# Altium project F1_MODULE.PrjPcb (part 2 of 2)

## Sheet PROTECTION AND POWER_SUPPLY.SchDoc
size A; SheetNumber: 4; SheetTotal: 4
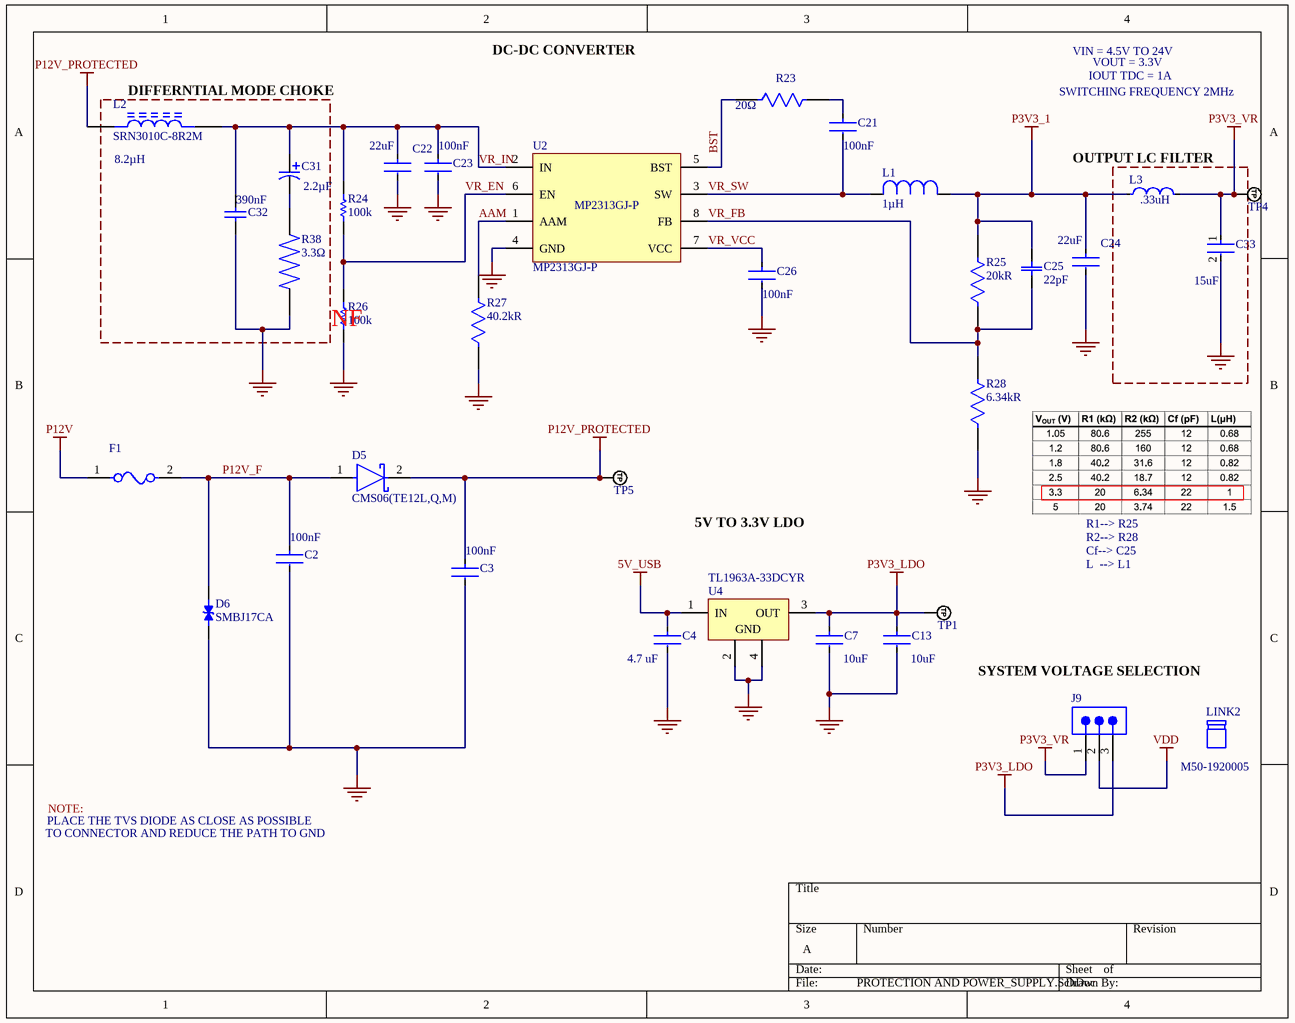
[diagram p3: PROTECTION AND POWER_SUPPLY.SchDoc]

### Parts
C2  Capacitance: 100nF  [FP-0402-L_1_0_0_05-W_0_5-MFG]  (hidden comment: TMK105B7104KVHF)
C3  Capacitance: 100nF  [FP-0402-L_1_0_0_05-W_0_5-MFG]  (hidden comment: TMK105B7104KVHF)
C4  Capacitance: 4.7 uF  [FP-CC0603-DA-MFG]  (hidden comment: CC0603KRX5R7BB475)
C7  Capacitance: 10uF  [FP-0805-L_2_0_0_2-W_1_25-MFG]  (hidden comment: EMK212BB7106KG-T)
C13  Capacitance: 10uF  [FP-0805-L_2_0_0_2-W_1_25-MFG]  (hidden comment: EMK212BB7106KG-T)
C21  Capacitance: 100nF  [FP-0402-L_1_0_0_05-W_0_5-MFG]  (hidden comment: TMK105B7104KVHF)
C22  Capacitance: 22uF  [FP-1210-L_3_2_0_3-W_2_5_0-MFG]  (hidden comment: TMK325B7226KMHP)
C23  Capacitance: 100nF  [FP-0402-L_1_0_0_05-W_0_5-MFG]  (hidden comment: TMK105B7104KVHF)
C24  Capacitance: 22uF  [FP-1210-L_3_2_0_3-W_2_5_0-MFG]  (hidden comment: TMK325B7226KMHP)
C25  value 22pF  [CAP_0805]  (hidden comment: 0805YA220K4T2A)
C26  Capacitance: 100nF  [FP-0402-L_1_0_0_05-W_0_5-MFG]  (hidden comment: TMK105B7104KVHF)
C31  value 2.2µF  [CAP_EEE_B_PAN]  (hidden comment: EEE-1HA2R2SR)
C32  value 390nF  [CAPC0805(2012)110_N]  (hidden comment: C0805C394K5RACTU)
C33  Capacitance: 15uF  [FP-C2012-125-0_2-MFG]  (hidden comment: C2012X5R1E156M125AC)
D5  CMS06(TE12L,Q,M)  [FP-M-FLAT-MFG]
D6  SMBJ17CA  [SMBJSeries_LTF]
F1  MINISMDC110F/24-2  [FP-MINISMDC110F-24-2-MFG]  (value not drawn)
J9  61300311121  [61300311121]  (value not drawn)
L1  value 1µH  [IND_MDMK2020T1R0MM_TAY]  (hidden comment: MDMK2020T1R0MMV)
L2  SRN3010C-8R2M  value 8.2µH  [IND_SRN3010C-8R2M]
L3  Inductance value: .33uH  [FP-DFE201210U-MFG]  (hidden comment: DFE201210U-R33M=P2)
LINK2  M50-1920005  (mechanical)
R23  Resistance: 20Ω  [FP-RT0402-MFG]  (hidden comment: RT0402FRE0720RL)
R24  value 100k  [RESC1005X40X25NL05T10]  (hidden comment: RC0402FR-07100KL)
R25  Resistance: 20kR  [FP-AF0402-MFG]  (hidden comment: AF0402JR-0720KL)
R26  value 100k  [RESC1005X40X25NL05T10]  (hidden comment: RC0402FR-07100KL)
R27  Resistance: 40.2kR  [FP-AF0402-MFG]  (hidden comment: AF0402FR-0740K2L)
R28  Resistance: 6.34kR  [FP-MCT0603-MFG]  (hidden comment: MCT06030C6341FP500)
R38  value 3.3Ω  [RESC6331X80N]  (hidden comment: CRM2512-JW-3R3ELF)
TP1  TP_NOBOM  [PAD_RND_1MM]  (value not drawn)  (no BOM)
TP4  TP_NOBOM  [PAD_RND_1MM]  (value not drawn)  (no BOM)
TP5  TP_NOBOM  [PAD_RND_1MM]  (value not drawn)  (no BOM)
U2  MP2313GJ-P  [TSOT23-8_MP2313_MNP]
U4  TL1963A-33DCYR  [DCY0004A_N]

### Blocks framed on the sheet
DIFFERNTIAL MODE CHOKE: C31 C32 L2 R38

### Nets
5V_USB: C4.1 U4.1(IN)
GND: C2.2 C3.2 C4.2 C7.2 C13.2 C22.2 C23.2 C24.2 C26.2 C32.1 C33.2 D6.1 R26.1 R27.1 R28.1 R38.2 U2.4(GND) U4.2(GND) U4.4(GND)
P3V3_1: C24.1 C25.2 L1.1 L3.1 R25.2
P3V3_LDO: C7.1 C13.1 J9.3 TP1.1(TP) U4.3(OUT)
P3V3_VR: C33.1 J9.1 L3.2 TP4.1(TP)
P12V: F1.1
P12V_PROTECTED: C3.1 D5.2(C) L2.1 TP5.1(TP)
VDD: J9.2
AAM: R27.2 U2.1(AAM)
BST: R23.1 U2.5(BST)
P12V_F: C2.1 D5.1(A) D6.2 F1.2
VR_EN: R24.1 R26.2 U2.6(EN)
VR_FB: C25.1 R25.1 R28.2 U2.8(FB)
VR_IN: C22.1 C23.1 C31.1 C32.2 L2.2 R24.2 U2.2(IN)
VR_SW: C21.2 L1.2 U2.3(SW)
VR_VCC: C26.1 U2.7(VCC)
NetC21_1: C21.1 R23.2
NetC31_2: C31.2 R38.1

### Notes on the sheet
- DC-DC CONVERTER
- SWITCHING FREQUENCY 2MHz
- VIN = 4.5V TO 24V
- IOUT TDC = 1A
- VOUT = 3.3V
- (near L3) OUTPUT LC FILTER
- (near R26) NF
- 5V TO 3.3V LDO
- R1--> R25
- R2--> R28
- Cf--> C25
- L  --> L1
- SYSTEM VOLTAGE SELECTION
- TO CONNECTOR AND REDUCE THE PATH TO GND
- PLACE THE TVS DIODE AS CLOSE AS POSSIBLE
- NOTE:

### Library data of the parts
C2 C3 C23 C26 = CMP-14477-000162-2: 0.1 µF ±10% 25V Condensatori ceramici X7R 0402 (1005 metrico); Case/Package: 0402; Dielectric: X7R; Halogen Free: Halogen Free; Ratings: AEC-Q200; Lead Free: Lead Free; Case Code (Metric): 1005; Mount: Surface Mount; Max Operating Temperature: 125°C; Case Code (Imperial): 0402; Termination: SMD/SMT; Min Operating Temperature: -55°C; Weight: 2.3E-05oz; Width: 0.02inch; Height: 0.5mm; Thickness: 0.022inch; Voltage Rating (DC): 25V; RoHS Compliant: Yes; Length: 0.039inch; Voltage Rating: 25V; Package Quantity: 10000; Packaging: Tape and Reel; Tolerance: 10%
C4 = CMP-03422-001236-1: CAP CER 4.7UF 16V X5R 0603; Manufacturer: YAGEO; Temperature Coefficient: 15%; Material: Ceramic; Tolerance: 0.1; Temperature Characteristic: X5R; Footprint Url: http://www.yageo.com/exep/pages/download/literatures/UPY-C_GEN_24.pdf; ComponentLink2URL: http://www.yageo.com/documents/recent/UPY-GPHC_X7R_6.3V-to-50V_18.pdf; ComponentLink2Description: Datasheet; Device Class L3: Ceramic Capacitors; Category: Cap; Voltage Rating: 16 V; Automotive: No; Temperature Range High: +125°C; Value: 4.7 uF; Device Class L1: Passive Components; RoHS: TRUE; Manufacturer Part Number: CC0603KRX5R7BB475; Device Class L2: Capacitors; Voltage: 16 V; Height: 0.9mm; Temperature Range Low: -55°C; Temperature: -55°C to +125°C; Mouser Description: Multilayer Ceramic Capacitors MLCC - SMD/SMT 4.7uF 16V X5R 10%; Octopart: https://octopart.com/cc0603krx5r7bb475-yageo-34978295; Package: CC0603-DA; Lead Free: Yes; Digikey Description: CAP CER 4.7UF 16V X5R 0603
C7 C13 = CMP-14477-000192-1: CAP CER 10UF 16V X7R 0805; Tolerance: 10%; Case/Package: 0805; Min Operating Temperature: -55°C; Mount: Surface Mount; Length: 0.079inch; Thickness: 0.053inch; Packaging: Tape and Reel; RoHS Compliant: Yes; Width: 0.049inch; Max Operating Temperature: 125°C; Voltage Rating: 16V
C21 = CMP-14477-000162-2: None; Dielectric: X7R; Voltage Rating (DC): 25V; Tolerance: 10%; Case/Package: 0402; Halogen Free: Halogen Free; Ratings: AEC-Q200; Lead Free: Lead Free; Case Code (Metric): 1005; Mount: Surface Mount; Max Operating Temperature: 125°C; Case Code (Imperial): 0402; Termination: SMD/SMT; Min Operating Temperature: -55°C; Weight: 2.3E-05oz; Width: 0.02inch; Height: 0.5mm; Thickness: 0.022inch; RoHS Compliant: Yes; Length: 0.039inch; Voltage Rating: 25V; Package Quantity: 10000; Packaging: Tape and Reel
C22 C24 = CMP-14477-002449-2: CAP CER 22UF 25V X7R 1210; Tolerance: 10%; Packaging: Tape and Reel; Voltage Rating: 25V; Length: 0.126inch; Mount: Surface Mount; RoHS Compliant: Yes; Min Operating Temperature: -55°C; Width: 0.098inch; Case/Package: 1210; Ratings: AEC-Q200; Max Operating Temperature: 125°C; Thickness: 0.106inch
C25 = 0805YA220K4T2A: Cap Ceramic 22pF 16V C0G 10% 0805 T/R; Manufacturer: KYOCERA AVX; Supplier: Mouser; Supplier Part Number: 581-0805YA220K4T2A; Manufacturer Part Number: 0805YA220K4T2A; RoHS: Compliant; Category: Ceramic Capacitors; Stock: 7924; Pricing: 1=0.21, 10=0.121, 50=0.121, 100=0.073, 1000=0.05, 10000=0.037 (USD); Case/Package: 0805; Voltage Rating (DC): 16V; ComponentLink1URL: https://datasheet.octopart.com/0805YA220K4T2A-KYOCERA-AVX-datasheet-13516023.pdf; ComponentLink1Description: https://datasheet.octopart.com/0805YA220K4T2A-KYOCERA-AVX-datasheet-13516023.pdf; ComponentLink2URL: http://sigma.octopart.com:80/reach_statement/AVX-company-19.pdf?src-supplier=Compliance+Statements; ComponentLink2Description: http://sigma.octopart.com:80/reach_statement/AVX-company-19.pdf?src-supplier=Compliance+Statements; ComponentLink3URL: http://sigma.octopart.com:80/conflict_mineral_statement/AVX-company-34.pdf?src-supplier=Compliance+Statements; ComponentLink3Description: http://sigma.octopart.com:80/conflict_mineral_statement/AVX-company-34.pdf?src-supplier=Compliance+Statements
C31 = EEE-1HA2R2SR: Radial Can - SMD ALUMINUM ELECTROLYTIC CAPACITOR S 50V 2.2muF ±20% 0.157Dia 4.00mm; Manufacturer: Panasonic; Dielectric Material: Aluminium; Dissipation Factor: 12%; Lead Length: 1.8mm; Leakage Current: 3µA; Life (Hours): 2000hours; Polarity: Polar; Ripple Current: 16mA; Supplier: Farnell; Supplier Part Number: 9697071; Manufacturer Part Number: EEE-1HA2R2SR; RoHS: Compliant; Category: Aluminum Electrolytic Capacitors; Stock: 716; Pricing: 5=0.173, 50=0.117, 250=0.107, 500=0.0852, 1000=0.0776 (EUR); Case/Package: Radial; China RoHS: Compliant; Contact Plating: Tin; Diameter: 4mm; Height: 5.4mm; Height - Seated (Max): 5.4102mm; Lead Free: Lead Free; Lead Pitch: 1mm; Length: 4.3mm; Lifecycle Status: NRND; Max Operating Temperature: 85°C; Min Operating Temperature: -40°C; Mounting Technology: Surface Mount; Pins: 2; Number of Terminals: 2; Packaging: Cut Tape; Radiation Hardening: No; REACH SVHC: Yes; Ripple Current (AC): 16mA; Schedule B: 8532220020, 8532220020|8532220020|8532220020|8532220020|8532220020|8532220020|8532220020|8532220020|8532220020|8532220020|8532220020|8532220020|8532220020|8532220020|8532220020|8532220020|8532220020|8532220020|8532220020|8532220020|8532220020|8532220020|8532220020|85; Termination: SMD/SMT; Tolerance: 20%; Voltage: 50V; Voltage Rating: 50V; Voltage Rating (AC): 50V; Voltage Rating (DC): 50V; Width: 4.3mm; ComponentLink1URL: https://datasheet.octopart.com:443/EEE-1HA2R2SR-Panasonic-datasheet-13265900.pdf?src-supplier=RS+(Formerly+Allied+Electronics); ComponentLink1Description: https://datasheet.octopart.com:443/EEE-1HA2R2SR-Panasonic-datasheet-13265900.pdf?src-supplier=RS+(Formerly+Allied+Electronics); ComponentLink2URL: https://datasheet.octopart.com:443/EEE-1HA2R2SR-Panasonic-datasheet-41169183.pdf?src-supplier=Newark; ComponentLink2Description: https://datasheet.octopart.com:443/EEE-1HA2R2SR-Panasonic-datasheet-41169183.pdf?src-supplier=Newark; ComponentLink3URL: https://datasheet.octopart.com:443/EEE-1HA2R2SR-Panasonic-datasheet-1290.pdf?src-supplier=Newark; ComponentLink3Description: https://datasheet.octopart.com:443/EEE-1HA2R2SR-Panasonic-datasheet-1290.pdf?src-supplier=Newark; ComponentLink4URL: https://datasheet.octopart.com:443/EEE1HA2R2SR-Panasonic-datasheet-136608603.pdf?src-supplier=Newark; ComponentLink4Description: https://datasheet.octopart.com:443/EEE1HA2R2SR-Panasonic-datasheet-136608603.pdf?src-supplier=Newark; ComponentLink5URL: https://datasheet.octopart.com:443/EEE-1HA2R2SR-Panasonic-datasheet-62330071.pdf?src-supplier=Panasonic+SCT; ComponentLink5Description: https://datasheet.octopart.com:443/EEE-1HA2R2SR-Panasonic-datasheet-62330071.pdf?src-supplier=Panasonic+SCT; ComponentLink6URL: https://sigma.octopart.com:443/150570760/technical_drawing/Panasonic-EEE1HA2R2SR.pdf?src-supplier=Panasonic+SCT; ComponentLink6Description: https://sigma.octopart.com:443/150570760/technical_drawing/Panasonic-EEE1HA2R2SR.pdf?src-supplier=Panasonic+SCT; ComponentLink7URL: https://datasheet.octopart.com:443/EEE-1HA2R2SR-Panasonic-datasheet-34230028.pdf?src-supplier=Farnell; ComponentLink7Description: https://datasheet.octopart.com:443/EEE-1HA2R2SR-Panasonic-datasheet-34230028.pdf?src-supplier=Farnell; ComponentLink8URL: https://datasheet.octopart.com:443/EEE1HA2R2SR-Panasonic-datasheet-7555708.pdf?src-supplier=Farnell; ComponentLink8Description: https://datasheet.octopart.com:443/EEE1HA2R2SR-Panasonic-datasheet-7555708.pdf?src-supplier=Farnell; ComponentLink9URL: https://datasheet.octopart.com:443/EEE1HA2R2SR-Panasonic-datasheet-5318435.pdf?src-supplier=Farnell; ComponentLink9Description: https://datasheet.octopart.com:443/EEE1HA2R2SR-Panasonic-datasheet-5318435.pdf?src-supplier=Farnell; ComponentLink10URL: https://datasheet.octopart.com:443/EEE1HA2R2SR-Panasonic-datasheet-5316599.pdf?src-supplier=Farnell; ComponentLink10Description: https://datasheet.octopart.com:443/EEE1HA2R2SR-Panasonic-datasheet-5316599.pdf?src-supplier=Farnell; ComponentLink11URL: https://datasheet.octopart.com:443/EEE1HA2R2SR-Panasonic-datasheet-5390910.pdf?src-supplier=Farnell; ComponentLink11Description: https://datasheet.octopart.com:443/EEE1HA2R2SR-Panasonic-datasheet-5390910.pdf?src-supplier=Farnell; ComponentLink12URL: https://datasheet.octopart.com:443/EEE1HA2R2SR-Panasonic-datasheet-7550061.pdf?src-supplier=Farnell; ComponentLink12Description: https://datasheet.octopart.com:443/EEE1HA2R2SR-Panasonic-datasheet-7550061.pdf?src-supplier=Farnell; ComponentLink13URL: https://datasheet.octopart.com:443/EEE1HA2R2SR-Panasonic-datasheet-8161.pdf?src-supplier=Farnell; ComponentLink13Description: https://datasheet.octopart.com:443/EEE1HA2R2SR-Panasonic-datasheet-8161.pdf?src-supplier=Farnell; ComponentLink14URL: https://datasheet.octopart.com:443/EEE1HA2R2SR-Panasonic-datasheet-1770.pdf?src-supplier=Farnell; ComponentLink14Description: https://datasheet.octopart.com:443/EEE1HA2R2SR-Panasonic-datasheet-1770.pdf?src-supplier=Farnell; ComponentLink15URL: https://datasheet.octopart.com:443/EEE1HA2R2SR-Panasonic-datasheet-2601.pdf?src-supplier=Farnell; ComponentLink15Description: https://datasheet.octopart.com:443/EEE1HA2R2SR-Panasonic-datasheet-2601.pdf?src-supplier=Farnell; ComponentLink16URL: https://datasheet.octopart.com:443/EEE1HA2R2SR-Panasonic-datasheet-122249.pdf?src-supplier=Farnell; ComponentLink16Description: https://datasheet.octopart.com:443/EEE1HA2R2SR-Panasonic-datasheet-122249.pdf?src-supplier=Farnell; ComponentLink17URL: https://datasheet.octopart.com:443/EEE1HA2R2SR-Panasonic-datasheet-4056.pdf?src-supplier=Farnell; ComponentLink17Description: https://datasheet.octopart.com:443/EEE1HA2R2SR-Panasonic-datasheet-4056.pdf?src-supplier=Farnell; ComponentLink18URL: https://datasheet.octopart.com:443/EEE-1HA2R2SR-Panasonic-datasheet-5314063.pdf?src-supplier=Future+Electronics; ComponentLink18Description: https://datasheet.octopart.com:443/EEE-1HA2R2SR-Panasonic-datasheet-5314063.pdf?src-supplier=Future+Electronics; ComponentLink19URL: https://datasheet.octopart.com:443/EEE-1HA2R2SR-Panasonic-datasheet-154766114.pdf?src-supplier=Master+Electronics; ComponentLink19Description: https://datasheet.octopart.com:443/EEE-1HA2R2SR-Panasonic-datasheet-154766114.pdf?src-supplier=Master+Electronics; ComponentLink20URL: https://datasheet.octopart.com:443/EEE-1HA2R2SR-Panasonic-datasheet-11548988.pdf?src-supplier=Arrow+Electronics; ComponentLink20Description: https://datasheet.octopart.com:443/EEE-1HA2R2SR-Panasonic-datasheet-11548988.pdf?src-supplier=Arrow+Electronics; ComponentLink21URL: https://datasheet.octopart.com:443/EEE1HA2R2SR-Panasonic-datasheet-150469818.pdf?src-supplier=TME; ComponentLink21Description: https://datasheet.octopart.com:443/EEE1HA2R2SR-Panasonic-datasheet-150469818.pdf?src-supplier=TME; ComponentLink22URL: https://datasheet.octopart.com:443/EEE1HA2R2SR-Panasonic-datasheet-147453673.pdf?src-supplier=Electro+Sonic; ComponentLink22Description: https://datasheet.octopart.com:443/EEE1HA2R2SR-Panasonic-datasheet-147453673.pdf?src-supplier=Electro+Sonic; ComponentLink23URL: https://datasheet.octopart.com:443/EEE-1HA2R2SR-Panasonic-datasheet-6019.pdf?src-supplier=DigiKey; ComponentLink23Description: https://datasheet.octopart.com:443/EEE-1HA2R2SR-Panasonic-datasheet-6019.pdf?src-supplier=DigiKey
C32 = CMP-1036-04624-1: CAP 390nF 50V ±10% 0805 (2012 Metric) Thickness 1.1mm SMD; Tolerance: Â±10%; Case-EIA: 0805; Case-Metric: 2012; Max Thickness: 1.1 mm; Technology: SMT; Rated Voltage: 50 V
C33 = CMP-08246-004727-1: Multilayer Ceramic Capacitors 15μF ±20% 25V X5R SMD 0805; Weight: 0.000194oz; Width: 0.049inch; Min Operating Temperature: -55°C; Depth: 1.25mm; Voltage Rating: 25V; Case/Package: 0805; Resistor Type: Ceramic; Max Operating Temperature: 85°C; Series: C; Mount: Surface Mount; Packaging: Tape and Reel; Thickness: 0.057inch; Tolerance: 20%; Dielectric Material: Ceramic; Lead Free: Lead Free; Dielectric: X5R; Case Code (Metric): 2012; Termination: SMD/SMT; RoHS Compliant: Yes; Package Quantity: 1; Case Code (Imperial): 0805; Length: 2mm; Voltage Rating (DC): 25V; Height: 1.25mm
D5 = CMP-2000-06115-2: DIODE SCHOTTKY 30V 2A MFLAT; Forward Voltage: 370mV; Peak Non-Repetitive Surge Current: 40A; Max Reverse Leakage Current: 3mA; Element Configuration: Single; Package Quantity: 1; Max Operating Temperature: 125°C; Mount: Surface Mount; Max Repetitive Reverse Voltage (Vrrm): 30V; Forward Current: 2A; Number of Pins: 2; Min Operating Temperature: -40°C; Radiation Hardening: No; Average Rectified Current: 2A; Contact Plating: Tin; Max Reverse Voltage (DC): 30V; Peak Reverse Current: 3mA; Max Surge Current: 40A; Packaging: Tape and Reel
D6 = SMBJ17CA: DO-214AA SMB SMBJ Surface Mount 1 Zener Tvs Diode 18.9V 21.7A 600W -55C~150C TJ; Manufacturer: Taiwan Semiconductor; Manufacturer Lifecycle Status: ACTIVE; Breakdown Voltage: 19.9V; Clamping Voltage: 27.6V; Forward Voltage: 1V; Max Breakdown Voltage: 20.9V; Max Forward Surge Current (Ifsm): 2.5A; Max Junction Temperature (Tj): 150°C; Max Power Dissipation: 3W; Max Repetitive Reverse Voltage (Vrrm): 250V; Max Reverse Leakage Current: 1µA; Max Surge Current: 100A; Number of Channels: 1; Operating Supply Voltage: 17V; Peak Pulse Current: 22.8A; Polarity: Bidirectional; Power Dissipation: 200mW; Reverse Recovery Time: 50ns; Supplier: Arrow Electronics; Supplier Part Number: SMBJ17CA; Manufacturer Part Number: SMBJ17CA; RoHS: Compliant; Category: TVS Diodes; Stock: 5190; Pricing: 741=0.476, 1000=0.476, 3000=0.475 (USD); China RoHS: Non-Compliant; Height: 2.44mm; Lead Free: Lead Free; Length: 5.59mm; Lifecycle Status: Production; Max Operating Temperature: 150°C; Min Breakdown Voltage: 18.9V; Min Operating Temperature: -55°C; Number of Elements: 1; Pins: 2; Number of Terminals: 2; Peak Pulse Power: 600W; Peak Reverse Current: 1µA; Power Rating: 600W; REACH SVHC: No; Reverse Standoff Voltage: 17V; Schedule B: 8541100080; Voltage Rating (DC): 17V; Width: 3.94mm; ComponentLink1URL: https://datasheet.octopart.com:443/SMBJ17CA-Taiwan-Semiconductor-datasheet-151942224.pdf?src-supplier=Newark; ComponentLink1Description: https://datasheet.octopart.com:443/SMBJ17CA-Taiwan-Semiconductor-datasheet-151942224.pdf?src-supplier=Newark; ComponentLink2URL: https://datasheet.octopart.com:443/SMBJ17CA-Taiwan-Semiconductor-datasheet-94061883.pdf?src-supplier=Newark; ComponentLink2Description: https://datasheet.octopart.com:443/SMBJ17CA-Taiwan-Semiconductor-datasheet-94061883.pdf?src-supplier=Newark; ComponentLink3URL: https://datasheet.octopart.com:443/SMBJ17CA-Taiwan-Semiconductor-datasheet-181551140.pdf?src-supplier=IHS; ComponentLink3Description: https://datasheet.octopart.com:443/SMBJ17CA-Taiwan-Semiconductor-datasheet-181551140.pdf?src-supplier=IHS; ComponentLink4URL: https://datasheet.octopart.com:443/SMBJ17CA-Taiwan-Semiconductor-datasheet-182396145.pdf?src-supplier=IHS; ComponentLink4Description: https://datasheet.octopart.com:443/SMBJ17CA-Taiwan-Semiconductor-datasheet-182396145.pdf?src-supplier=IHS; ComponentLink5URL: https://datasheet.octopart.com:443/SMBJ17CA-Taiwan-Semiconductor-datasheet-180789127.pdf?src-supplier=IHS; ComponentLink5Description: https://datasheet.octopart.com:443/SMBJ17CA-Taiwan-Semiconductor-datasheet-180789127.pdf?src-supplier=IHS; ComponentLink6URL: https://datasheet.octopart.com:443/SMBJ17CA-Taiwan-Semiconductor-datasheet-137249696.pdf?src-supplier=Taiwan+Semiconductor; ComponentLink6Description: https://datasheet.octopart.com:443/SMBJ17CA-Taiwan-Semiconductor-datasheet-137249696.pdf?src-supplier=Taiwan+Semiconductor; ComponentLink7URL: https://datasheet.octopart.com:443/SMBJ17CA-Taiwan-Semiconductor-datasheet-34355353.pdf?src-supplier=Taiwan+Semiconductor; ComponentLink7Description: https://datasheet.octopart.com:443/SMBJ17CA-Taiwan-Semiconductor-datasheet-34355353.pdf?src-supplier=Taiwan+Semiconductor
F1 = CMP-08606-000001-1: PTC RESET FUSE 24V 1.1A 1812; Manufacturer: Littelfuse; Value: 0.06-0.18Ω; Trip Time: 0.5s; Current Rating: 20A; Trip Current: 2.2A; Ambient Temperature Range High: +85°C; Voltage Rating: 24V; Category: Fuse; RoHS: TRUE; Digikey Description: PTC RESET FUSE 24V 1.1A 1812; ComponentLink2Description: Datasheet; Hold Current: 1.1A; Temperature: -40°C to +85°C; Device Class L3: unset; ComponentLink2URL: https://www.littelfuse.com/~/media/electronics/datasheets/resettable_ptcs/littelfuse_ptc_minismdc_datasheet.pdf.pdf; Device Class L2: PTC Resettable Fuses; Manufacturer Part Number: MINISMDC110F/24-2; Ambient Temperature Range Low: -40°C; Height: 1.46mm; Lead Free: Yes; Temperature Range High: +85°C; Device Class L1: Circuit Protection; Package: 0; Octopart: https://octopart.com/minismdc110f%2F24-2-littelfuse-74215018; Automotive: No; Resistance: 0.06-0.18Ω; Temperature Range Low: -40°C
J9 = CMP-1502-01062-3: CONN HEADER VERT 3POS 2.54MM; NexarPartId: 32855521; Current Rating: 3A; Voltage Rating: 250V; Number of Positions: 3; Contact Resistance: 20mΩ; Connector Type: Male Pin; Gender: Male; REACH SVHC: Unknown; Packaging: Bulk; Contact Material: Copper; Pitch: 2.54mm; Min Operating Temperature: -40°C; Number of Rows: 1; Orientation: Vertical; RoHS: Compliant; Contact Plating: Gold; Max Operating Temperature: 105°C; Mount: Through Hole; Height: 8.94mm; Operating Supply Voltage: 250V; Number of Pins: 3; Contact Mating Length: 5.9944mm; Number of Contacts: 3; Color: Black; Lead Free: Lead Free; Lead Pitch: 2.54mm; Termination: Solder
L1 = MDMK2020T1R0MMV: Inductor Power Shielded Wirewound 1uH 20% 1MHz Metal 1.9A 0.064Ohm DCR Automotive T/R; Manufacturer: Taiyo Yuden; DC Resistance (DCR): 64mΩ; Max Saturation Current: 2.55A; Number of Circuits: 1; Saturation Current: 2.9A; Shielding: No; Temperature Rise Current: 2.05A; Supplier: DigiKey; Supplier Part Number: 587-4110-1-ND; Manufacturer Part Number: MDMK2020T1R0MMV; RoHS: Compliant; Category: Fixed Inductors; Stock: 4551; Pricing: 1=0.49, 10=0.399, 25=0.3692, 50=0.348, 100=0.3282, 250=0.30356, 500=0.28622, 1000=0.26987 (USD); Case/Package: 0808; Case Code (Imperial): 0808; Composition: Wirewound; Core Material: Metal; Current Rating: 1.9A; Height: 1.2mm; Height - Seated (Max): 1.1938mm; Length: 2.0066mm; Lifecycle Status: Production; Max Current Rating: 1.9A; Max DC Current: 1.9A; Max Length: 2.15mm; Max Operating Temperature: 125°C; Max Temperature Rise Current: 1.9A; Max Width: 2.15mm; Min Length: 1.85mm; Min Operating Temperature: -40°C; Min Width: 1.85mm; Mounting Technology: Surface Mount; Number of Terminals: 2; Packaging: Tape & Reel (TR); Ratings: AEC-Q200; REACH SVHC: Yes; Termination: SMD/SMT; Test Frequency: 1MHz; Tolerance: 20%; Width: 2mm; ComponentLink1URL: https://datasheet.octopart.com:443/MDMK2020T1R0MMV-Taiyo-Yuden-datasheet-181261916.pdf?src-supplier=IHS; ComponentLink1Description: https://datasheet.octopart.com:443/MDMK2020T1R0MMV-Taiyo-Yuden-datasheet-181261916.pdf?src-supplier=IHS; ComponentLink2URL: https://datasheet.octopart.com:443/MDMK2020T1R0MMV-Taiyo-Yuden-datasheet-141253780.pdf?src-supplier=Taiyo+Yuden+SCT; ComponentLink2Description: https://datasheet.octopart.com:443/MDMK2020T1R0MMV-Taiyo-Yuden-datasheet-141253780.pdf?src-supplier=Taiyo+Yuden+SCT
L2 = SRN3010C-8R2M: General Purpose Inductor, 8.2uH, 20%, 1 Element, Ferrite-Core, SMD, 1212; Manufacturer: Bourns; DC Resistance (DCR): 396mΩ; Max Current Rating: 1.3A; Number of Circuits: 1; Self Resonant Frequency: 45MHz; Shielding: Yes; Test Frequency: 100kHz; Supplier: Farnell; Supplier Part Number: 4176523; Manufacturer Part Number: SRN3010C-8R2M; RoHS: Compliant; Category: Fixed Inductors; Stock: 2960; Pricing: 5=0.329, 50=0.264, 250=0.202, 500=0.186, 1500=0.164 (EUR); Case/Package: 1212; Core Material: Ferrite; Height: 900µm; Lifecycle Status: Production; Max Operating Temperature: 125°C; Min Operating Temperature: -40°C; Number of Terminals: 2; REACH SVHC: Yes; Tolerance: 20%; Width: 3mm; ComponentLink1URL: https://datasheet.octopart.com:443/SRN3010C-8R2M-Bourns-datasheet-179982194.pdf?src-supplier=IHS; ComponentLink1Description: https://datasheet.octopart.com:443/SRN3010C-8R2M-Bourns-datasheet-179982194.pdf?src-supplier=IHS; ComponentLink2URL: http://sigma.octopart.com:80/conflict_mineral_statement/Bourns-company-36.pdf?src-supplier=Compliance+Statements; ComponentLink2Description: http://sigma.octopart.com:80/conflict_mineral_statement/Bourns-company-36.pdf?src-supplier=Compliance+Statements
L3 = CMP-06042-016608-1: FIXED IND .33UH 3.4A 31MOHM; RoHS Compliant: Yes
LINK2 = M50-1920005: CONN SHUNT 1.27MM RED; Manufacturer: Harwin; Manufacturer Series: M50; Connector Type: Interconnection Device; Body/Shell Style: PLUG; Contact Pattern: RECTANGULAR; Contact Resistance: 20mR; Durability: 300Cycles; Insulation Resistance: 1GR; Number Of Connectors: 1; Rated Current (Signal): 1A; Number of Contacts: 2; Dielectric Withstanding Voltage (AC): 500V; Body Breadth: 0.059inch; Body Length: 0.098inch; Mating Contact Pitch: 0.05inch; Body Depth: 0.118inch; Reference Standard: UL; Reliability: COMMERCIAL; Supplier: Digikey; Supplier Part Number: 952-1727-ND; Manufacturer Part Number: M50-1920005; RoHS: Yes; Category: Headers and Wire Housings; Stock: 4401; Pricing: 1=0.43, 10=0.363, 25=0.3196, 50=0.2936, 100=0.2821, 250=0.25332, 500=0.2418, 1000=0.2015, 2500=0.18422 (USD); Contact Finish - Mating: AU ON NI; Contact Finish - Termination: Gold (Au); Insulation Color: Red; Insulation Material: Nylon; Contact Material: Copper Alloy; Min Operating Temperature: -40°C; Max Operating Temperature: 105°C; JESD-609 Code: e4; Contact Gender: Female; Mounting Style: STRAIGHT; Number of Rows Loaded: 1; Reach SVHC Compliant: Yes; RoHS Compliant: Yes; ComponentLink1URL: https://datasheet.ciiva.com:443/pdfs/VipMasterIC/IC/HRWN/HRWNS04645/HRWNS04645-1.pdf?src-supplier=IHS+Markit; ComponentLink1Description: https://datasheet.ciiva.com:443/pdfs/VipMasterIC/IC/HRWN/HRWNS04645/HRWNS04645-1.pdf?src-supplier=IHS+Markit; ComponentLink2URL: https://datasheet.ciiva.com/4573/m50-19x-350826-4573042.pdf?src-supplier=Mouser; ComponentLink2Description: https://datasheet.ciiva.com/4573/m50-19x-350826-4573042.pdf?src-supplier=Mouser; ComponentLink3URL: https://datasheet.ciiva.com/1412/1836978-1412125.pdf?src-supplier=Element14; ComponentLink3Description: https://datasheet.ciiva.com/1412/1836978-1412125.pdf?src-supplier=Element14; ComponentLink4URL: https://datasheet.ciiva.com/767/m50-19x-767921.pdf?src-supplier=Digikey; ComponentLink4Description: https://datasheet.ciiva.com/767/m50-19x-767921.pdf?src-supplier=Digikey; ComponentLink5URL: https://datasheet.ciiva.com/1456/m50-19x-1456640.pdf?src-supplier=Newark; ComponentLink5Description: https://datasheet.ciiva.com/1456/m50-19x-1456640.pdf?src-supplier=Newark; LCSC Part Number: C6985646
R23 = CMP-2002-02569-2: RES SMD 20 OHM 1% 1/16W 0402; Manufacturer: Yageo; Value: 20Ω; Power Rating: 0.063W; Voltage Rating: 50V; Temperature Coefficient: 50 ppm/°C; Tolerance: 0.01; ComponentLink2Description: Datasheet; RoHS: TRUE; Temperature: -55°C to +155°C; Height: 0.35mm; Manufacturer Part Number: RT0402FRE0720RL; Temperature Range High: +155°C; Device Class L1: Passive Components; Automotive: No; Lead Free: Yes; ComponentLink2URL: http://www.yageo.com/documents/recent/PYu-RT_1-to-0.01_RoHS_L_9.pdf; Composition: Thin Film; Digikey Description: RES SMD 20 OHM 1% 1/16W 0402; Footprint Url: http://www.yageo.com/exep/pages/download/literatures/PYu-R_Mount_10.pdf; Series: RT; Category: Res; Octopart: https://octopart.com/rt0402fre0720rl-yageo-1278881; Temperature Range Low: -55°C; Ipc Land Pattern Name: RESC10050X30; Package: RT0402; Device Class L2: Resistors; Device Class L3: Chip SMD Resistors
R24 R26 = CMP-2002-07343-1: 100 kOhms ±1% 0.063W, 1/16W Chip Resistor 0402 (1005 Metric) Moisture Resistant Thick Film; Manufacturer: Yageo / Phycomp; Part Number: RC0402FR-07100KL
R25 = CMP-03412-045777-1: Anti-Sulfurated Chip Resistors Automotive Grade 20kΩ 5% 100ppm/°C 0402; Max Power Dissipation: 63mW; Width: 0.02inch; Height: 0.015inch; Case/Package: 0402; Tolerance: 5%; Min Operating Temperature: -55°C; Resistor Type: Thick Film; RoHS Compliant: Yes; Length: 0.039inch; Features: Moisture Resistant; Temperature Coefficient: 100ppm/°C; Number of Terminations: 2; Max Operating Temperature: 155°C; Packaging: Tape and Reel; Series: AF
R27 = CMP-03412-045117-1: Anti-Sulfurated Chip Resistors Automotive Grade 40.2kΩ 1% 100ppm/°C 0402; Max Power Dissipation: 63mW; Min Operating Temperature: -55°C; Length: 0.039inch; Features: Moisture Resistant; Packaging: Tape and Reel; Max Operating Temperature: 155°C; Number of Terminations: 2; Temperature Coefficient: 100ppm/°C; Width: 0.02inch; Tolerance: 1%; Height: 0.015inch; RoHS Compliant: Yes; Series: AF; Resistor Type: Thick Film; Case/Package: 0402
R28 = CMP-02407-002952-1: RES SMD 100 OHM 1% 1/8W 0603; Max Power Dissipation: 125mW; Temperature Coefficient: 50ppm/°C; Lead Free: Lead Free; Military Standard: Not; Length: 0.061inch; Package Quantity: 5000; Tolerance: 1%; Depth: 0.85mm; Number of Terminations: 2; Min Operating Temperature: -55°C; Composition: Thin Film; Width: 0.033inch; Packaging: Tape and Reel; Height: 0.022inch; Max Operating Temperature: 155°C; Case/Package: 0603
R38 = CRM2512-JW-3R3ELF: Res Thick Film 2512 3.3 Ohm 5% 2W ±200ppm/C Pad SMD T/R; Manufacturer: Bourns; Temperature Coefficient: 200ppm/°C; Working Voltage: 300V; Supplier: Farnell; Supplier Part Number: 2908504; Manufacturer Part Number: CRM2512-JW-3R3ELF; RoHS: Compliant; Category: Chip SMD Resistors; Stock: 3794; Pricing: 10=0.241, 100=0.159, 500=0.128, 1000=0.119, 2000=0.108, 4000=0.0989 (EUR); Case/Package: 2512; Case Code (Imperial): 2512; Case Code (Metric): 6432; China RoHS: Non-Compliant; Composition: Thick Film; Height: 600µm; Length: 6.2992mm; Lifecycle Status: Production; Max Operating Temperature: 155°C; Max Power Dissipation: 2W; Min Operating Temperature: -55°C; Mounting Technology: Surface Mount; Number of Terminals: 2; Number of Terminations: 2; Packaging: Tape & Reel (TR); Power Dissipation: 2W; Power Rating: 2W; REACH SVHC: Yes; Schedule B: 8533210045, 8533210045|8533210045|8533210045|8533210045|8533210045; Tolerance: 5%; Width: 3.1mm; ComponentLink1URL: https://datasheet.octopart.com:443/CRM2512-JW-3R3ELF-Bourns-datasheet-170520297.pdf?src-supplier=IHS; ComponentLink1Description: https://datasheet.octopart.com:443/CRM2512-JW-3R3ELF-Bourns-datasheet-170520297.pdf?src-supplier=IHS; ComponentLink2URL: https://datasheet.octopart.com:443/CRM2512-JW-3R3ELF-Bourns-datasheet-47549200.pdf?src-supplier=Burklin+Elektronik; ComponentLink2Description: https://datasheet.octopart.com:443/CRM2512-JW-3R3ELF-Bourns-datasheet-47549200.pdf?src-supplier=Burklin+Elektronik; ComponentLink3URL: https://datasheet.octopart.com:443/CRM2512-JW-3R3ELF-Bourns-datasheet-164353756.pdf?src-supplier=JRH+Electronics; ComponentLink3Description: https://datasheet.octopart.com:443/CRM2512-JW-3R3ELF-Bourns-datasheet-164353756.pdf?src-supplier=JRH+Electronics; ComponentLink4URL: https://datasheet.octopart.com:443/CRM2512-JW-3R3ELF-Bourns-datasheet-154729672.pdf?src-supplier=Electro+Sonic; ComponentLink4Description: https://datasheet.octopart.com:443/CRM2512-JW-3R3ELF-Bourns-datasheet-154729672.pdf?src-supplier=Electro+Sonic; ComponentLink5URL: https://datasheet.octopart.com:443/CRM2512-JW-3R3ELF-Bourns-datasheet-182141858.pdf?src-supplier=Master+Electronics; ComponentLink5Description: https://datasheet.octopart.com:443/CRM2512-JW-3R3ELF-Bourns-datasheet-182141858.pdf?src-supplier=Master+Electronics; ComponentLink6URL: http://sigma.octopart.com:80/conflict_mineral_statement/Bourns-company-36.pdf?src-supplier=Compliance+Statements; ComponentLink6Description: http://sigma.octopart.com:80/conflict_mineral_statement/Bourns-company-36.pdf?src-supplier=Compliance+Statements
TP1 TP4 TP5 = TEST_POINT_RND_1MM: Test Point Round 1mm (NO BOM)
U2 = MP2313GJ-P: Switching Voltage Regulators High Effic 1A,24V, 2MHz Syn StepDw Conv
U4 = CMP-0395-00535-2: Single Output Low Noise LDO, 1.5 A, Fixed 3.3 V Output, 2.1 to 20 V Input, 4-pin SOT-223 (DCY), -40 to 125 degC, Green (RoHS & no Sb/Br); Manufacturer: Texas Instruments; Vout Adj(Min)(V): 3.3; Vin(Max)(V): 20; SubFamily: Single Channel LDO; Iq(Typ)(mA): 1; Iout(Max)(A): 1.5; Vin(Min)(V): 2.1; Vdo(Typ)(mV): 340; Accuracy(%): 3; ComponentLink2Description: Datasheet; PackageVersion: 4202506/B; PackageReference: DCY0004A; ComponentLink1Description: Manufacturer URL; Eco-Plan: Green (RoHS & no Sb/Br); ComponentLink1URL: http://www.ti.com/; Fixed Output Options(V): 3.3; ComponentLink2URL: http://www.ti.com/general/docs/lit/getliterature.tsp?genericPartNumber=TL1963A-33&fileType=pdf; Vout Adj(Max)(V): 3.3; PackageDescription: 4-Pin Plastic Small Outline, Body 3.5 x 6.5 mm, Pitch 2.3 mm; ComponentLink3URL: http://www.ti.com/litv/pdf/mpds094a; DatasheetVersion: SLVS719F; PartNumber: TL1963A-33DCYR; Code_JEDEC: TO-261; Mounting Technology: Surface Mount; ComponentLink3Description: Package Specification

## Nets that join several sheets
5V_USB: CAN_USB_DISPLAY (5 pins), PROTECTION AND POWER_SUPPLY (C4.1 U4.1)
GND: MICROCONTROLLER (23 pins), CAN_USB_DISPLAY (18 pins), PROTECTION AND POWER_SUPPLY (19 pins)
P12V: CAN_USB_DISPLAY (J5.4), PROTECTION AND POWER_SUPPLY (F1.1)
VDD: MICROCONTROLLER (19 pins), CAN_USB_DISPLAY (6 pins), PROTECTION AND POWER_SUPPLY (J9.2)
CAN_D_N: MICROCONTROLLER (U1.46), CAN_USB_DISPLAY (U3.1)
CAN_D_P: MICROCONTROLLER (U1.45), CAN_USB_DISPLAY (U3.4)
DSP_PWR_EN: MICROCONTROLLER (U1.38), CAN_USB_DISPLAY (R17.1)
LCD_CS: MICROCONTROLLER (U1.14), CAN_USB_DISPLAY (J4.7)
LCD_D/C: MICROCONTROLLER (U1.18), CAN_USB_DISPLAY (J4.11)
LCD_MISO: MICROCONTROLLER (U1.16), CAN_USB_DISPLAY (J4.9)
LCD_MOSI: MICROCONTROLLER (U1.17), CAN_USB_DISPLAY (J4.10)
LCD_RST: MICROCONTROLLER (U1.19), CAN_USB_DISPLAY (J4.12)
LCD_SCK: MICROCONTROLLER (U1.15), CAN_USB_DISPLAY (J4.8)
OLED_SCK: MICROCONTROLLER (U1.21), CAN_USB_DISPLAY (R21.2)
OLED_SDA: MICROCONTROLLER (U1.22), CAN_USB_DISPLAY (R22.2)
PGM_LED_1: MICROCONTROLLER (U1.25), CAN_USB_DISPLAY (J4.6)
SWCLK: MICROCONTROLLER (U1.37), CAN_USB_DISPLAY (J3.2)
SWDIO: MICROCONTROLLER (U1.34), CAN_USB_DISPLAY (J3.3)
USB_P_PU: MICROCONTROLLER (U1.29), CAN_USB_DISPLAY (R12.2)
USB_R_N: MICROCONTROLLER (R7.1), CAN_USB_DISPLAY (J2.2)
USB_R_P: MICROCONTROLLER (R8.1), CAN_USB_DISPLAY (J2.3 R12.1)
USB_VBUS_R: MICROCONTROLLER (U1.30), CAN_USB_DISPLAY (J8.2)